# Altium schematic sheet raspberrypi.SchDoc: Test
size A4; DrawnBy: Łukasz Przeniosło; Organization: Zachodniopomorski; Address1: Uniwersytet Technologiczny; Address2: w Szczecinie; Address3: Wydział Elektryczny; DocumentNumber: 2; Revision: 1.0; SheetNumber: 2; SheetTotal: 8
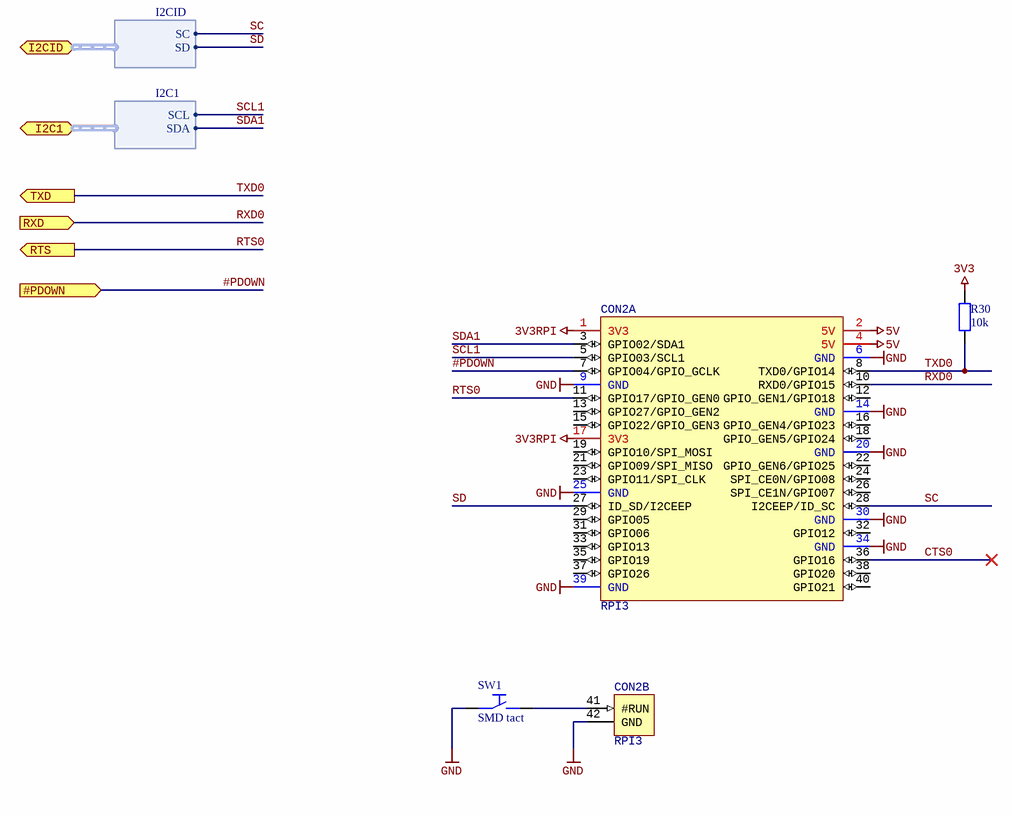
[diagram p0: raspberrypi.SchDoc]

## Parts
CON2  RPI3  [RaspberryPi3]  (parts A,B of 2)
R30  10k  [RESC1608N]
SW1  SMD tact  [ULTRA-SMALL-TACT-SWITCH-SMT]

## Ports
#PDOWN (in), I2C1 (harness I2C1), I2CID (harness I2CID), RTS (out), RXD (in), TXD (out)

## Harnesses
I2CID: SC, SD
I2C1: SCL, SDA

## Nets
3V3: R30.1
3V3RPI: CON2.1(3V3) CON2.17(3V3)
5V: CON2.2(5V) CON2.4(5V)
GND: CON2.6(GND) CON2.9(GND) CON2.14(GND) CON2.20(GND) CON2.25(GND) CON2.30(GND) CON2.34(GND) CON2.39(GND) CON2.42(GND) SW1.1
#PDOWN: CON2.7(GPIO04/GPIO_GCLK) ; port #PDOWN
CTS0: CON2.36(GPIO16)
RTS0: CON2.11(GPIO17/GPIO_GEN0) ; port RTS
RXD0: CON2.10(RXD0/GPIO15) ; port RXD
SC: CON2.28(I2CEEP/ID_SC) ; port I2CID.SC
SCL1: CON2.5(GPIO03/SCL1) ; port I2C1.SCL
SD: CON2.27(ID_SD/I2CEEP) ; port I2CID.SD
SDA1: CON2.3(GPIO02/SDA1) ; port I2C1.SDA
TXD0: CON2.8(TXD0/GPIO14) R30.2 ; port TXD
NetCON2_41: CON2.41(#RUN) SW1.2

Not connected (* = marked no-connect by the designer): CON2 12(GPIO_GEN1/GPIO18) 13(GPIO27/GPIO_GEN2) 15(GPIO22/GPIO_GEN3) 16(GPIO_GEN4/GPIO23) 18(GPIO_GEN5/GPIO24) 19(GPIO10/SPI_MOSI) 21(GPIO09/SPI_MISO) 22(GPIO_GEN6/GPIO25) 23(GPIO11/SPI_CLK) 24(SPI_CE0N/GPIO08) 26(SPI_CE1N/GPIO07) 29(GPIO05) 31(GPIO06) 32(GPIO12) 33(GPIO13) 35(GPIO19) 37(GPIO26) 38(GPIO20) 40(GPIO21)

## Notes on the sheet
- Title
- Size:
- Date:
- A4
- Author:
- Time:
- Sheet
- of
- File:

## Library data of the parts
CON2 = RaspberryPi3: Raspberry pi model 3B connector with step
R30 = Resistor: Tolerance: 1%; Power: 0W; Value: 10k
SW1 = DTSHW66NB: SWITCH, SPNO TACT; Published: 8-Jun-2000; LatestRevisionDate: 17-Jul-2002; LatestRevisionNote: Re-released for DXP Platform.; PackageDocument: Sep-1998; PackageReference: SOT-23A; Publisher: Altium Limited; ComponentLink1Description: Manufacturer Link; ComponentLink2Description: Datasheet; Distributor: tme.pl; tme.pl: DTSHW66NB